# EasyEDA Pro project SoPi.epro, schematic Schematic1
Board Name: Board1; Create Date: 2026-04-29; Page Name: P1; Project Name: My_F1C200S; Schematic Name: Schematic1; Update Date: 2026-05-15; Add into BOM: yes; Company: 嘉立创EDA; Convert to PCB: yes; Page Size: A4; Version: V1.0
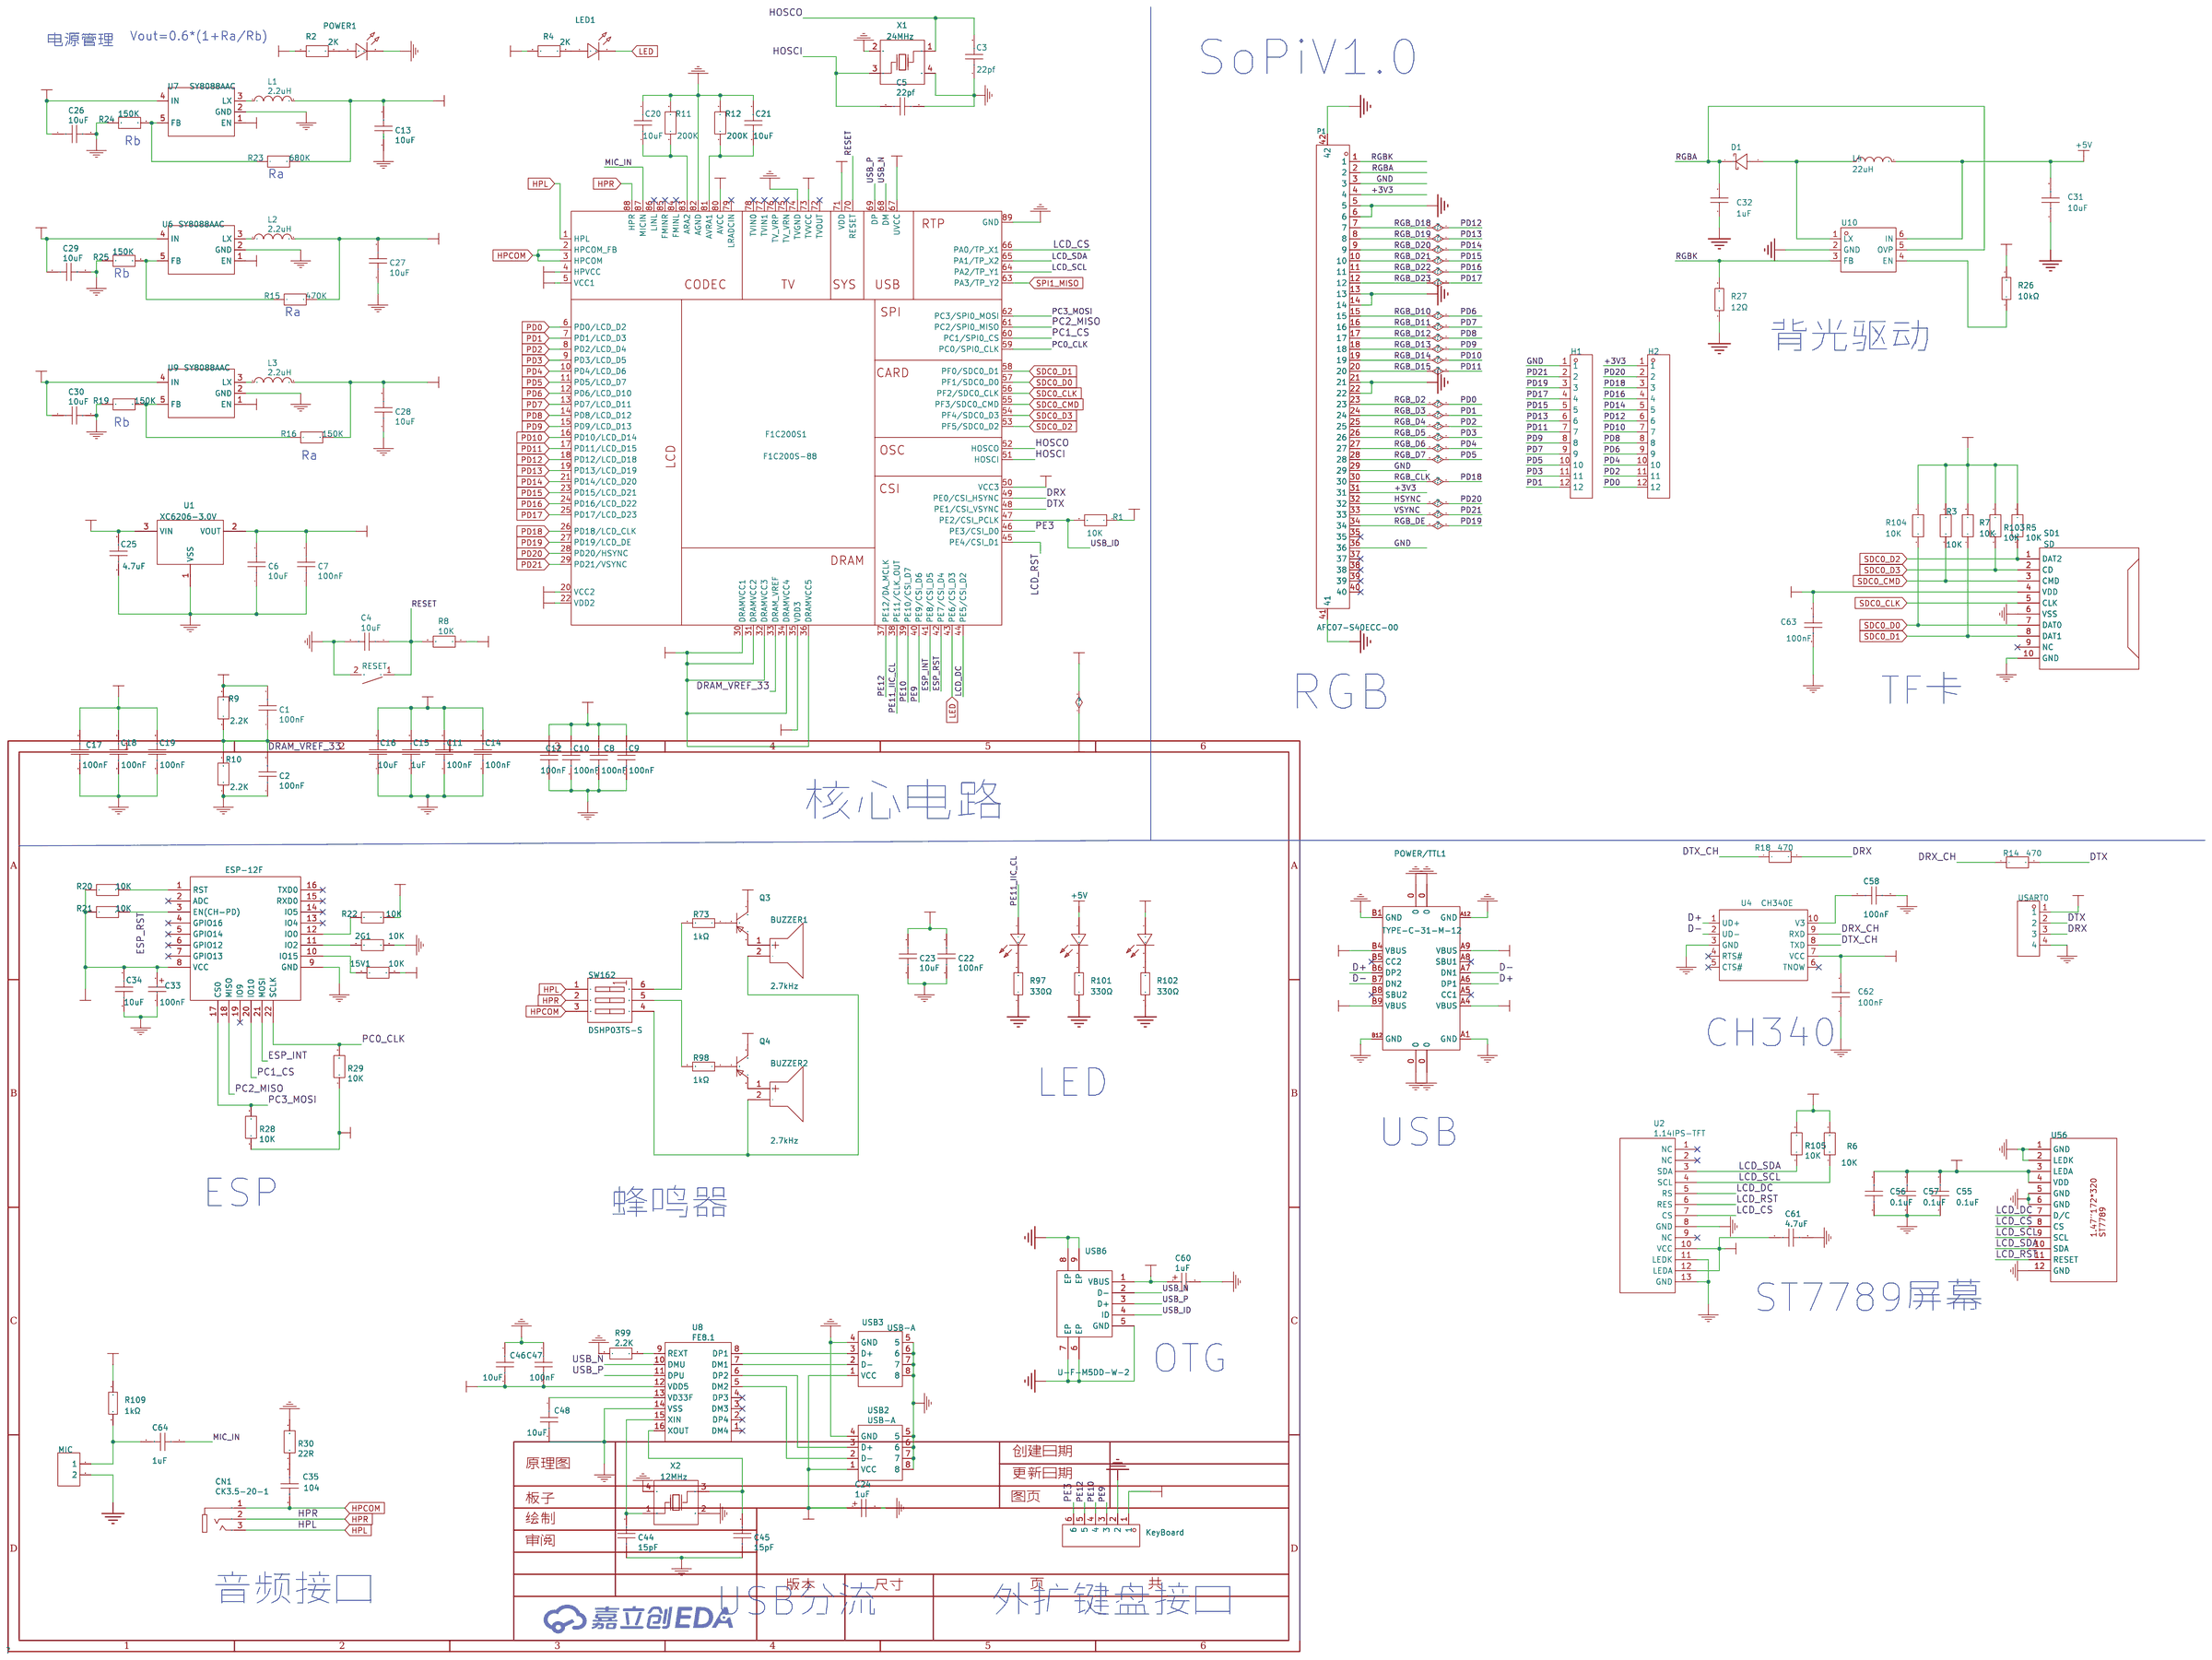
[diagram p0: schematic sheet]

## Parts
2G1  10K  [R0603]
15V1  10K  [R0603]
BUZZER1  2.7kHz  [BUZ-TH_BD9.0-P5.00-D0.6-FD]
BUZZER2  2.7kHz  [BUZ-TH_BD9.0-P5.00-D0.6-FD]
C1  100nF  [C0603]
C2  100nF  [C0603]
C3  22pf  [C0603]
C4  10uF  [C0603]
C5  22pf  [C0603]
C6  10uF  [C0603]
C7  100nF  [C0603]
C8  100nF  [C0603]
C9  100nF  [C0603]
C10  100nF  [C0603]
C11  100nF  [C0603]
C12  100nF  [C0603]
C13  10uF  [C0603]
C14  100nF  [C0603]
C15  1uF  [C0603]
C16  10uF  [C0603]
C17  100nF  [C0603]
C18  100nF  [C0603]
C19  100nF  [C0603]
C20  10uF  [C0603]
C21  10uF  [C0603]
C22  100nF  [C0603]
C23  10uF  [C0603]
C24  1uF  [CAP-SMD_L3.5-W2.8-R-RD]
C25  4.7uF  [C0603]
C26  10uF  [C0603]
C27  10uF  [C0603]
C28  10uF  [C0603]
C29  10uF  [C0603]
C30  10uF  [C0603]
C31  10uF  [C0603]
C32  1uF  [C0603]
C33  100nF  [CAP-SMD_L3.5-W2.8-R-RD]
C34  10uF  [C0603]
C35  104  [C0603]
C44  15pF  [C0603]
C45  15pF  [C0603]
C46  10uF  [C0603]
C47  100nF  [C0603]
C48  10uF  [C0603]
C55  0.1uF  [C0603]
C56  0.1uF  [C0603]
C57  0.1uF  [C0603]
C58  100nF  [C0603]
C60  1uF  [CAP-SMD_L3.5-W2.8-R-RD]
C61  4.7uF  [C0603]
C62  100nF  [C0603]
C63  100nF  [C0603]
C64  1uF  [C0603]
CN1  CK3.5-20-1  [AUDIO-SMD_CK3.5-20-1]
D1  -  [SMA_L4.3-W2.5-LS5.0-RD]
F1C200S1  F1C200S-88  [F1C100S/F1C200S]
H1  -  [HDR-TH_12P-P2.54-V-M]
H2  -  [HDR-TH_12P-P2.54-V-M]
KeyBoard  -  [HDR-TH_6P-P2.54-V-F]
L1  2.2uH  [L0805]
L2  2.2uH  [L0805]
L3  2.2uH  [L0805]
L4  22uH  [IND-SMD_L4.5-W4.0_SM4532]
LED1  0603  [LED0603_RED]
LED96  KT-0805G  [LED0805-R-RD]
LED97  KT-0805G  [LED0805-R-RD]
LED98  KT-0805G  [LED0805-R-RD]
MIC  -  [HDR-TH_2P-P2.54-V-F]
P1  AFC07-S40ECC-00  [CONN-SMD_AFC07-S40ECC-00]
POWER1  0603  [LED0603_RED]
POWER/TTL1  TYPE-C-31-M-12  [USB-C_SMD-TYPE-C-31-M-12]
Q3  S8550  [SOT-23-3_L2.9-W1.3-P1.90-LS2.4-BR]
Q4  S8550  [SOT-23-3_L2.9-W1.3-P1.90-LS2.4-BR]
R1  10K  [R0603]
R2  2K  [R0603]
R3  10K  [R0603]
R4  2K  [R0603]
R5  10K  [R0603]
R6  10K  [R0603]
R7  10K  [R0603]
R8  10K  [R0603]
R9  2.2K  [R0603]
R10  2.2K  [R0603]
R11  200K  [R0603]
R12  200K  [R0603]
R14  470  [R0603]
R15  470K  [R0603]
R16  150K  [R0603]
R18  470  [R0603]
R19  150K  [R0603]
R20  10K  [R0603]
R21  10K  [R0603]
R22  10K  [R0603]
R23  680K  [R0603]
R24  150K  [R0603]
R25  150K  [R0603]
R26  10kΩ  [R0603]
R27  12Ω  [R0603]
R28  10K  [R0603]
R29  10K  [R0603]
R30  22R  [R0603]
R73  1kΩ  [R0603]
R97  330Ω  [R0603]
R98  1kΩ  [R0603]
R99  2.2K  [R0603]
R101  330Ω  [R0603]
R102  330Ω  [R0603]
R103  10K  [R0603]
R104  10K  [R0603]
R105  10K  [R0603]
R109  1kΩ  [R0603]
RESET  ST-1185S  [SW-SMD_ST-1185S]
SD1  SD  [TF-SMD_TF-115K]
SW162  DSHP03TS-S  [SW-SMD_DSHP03TS-S]
U1  XC6206-3.0V  [SOT-23]
U2  1.14IPS-TFT  [1.14IPS]
U3  ESP-12F  [WIFIM-SMD_ESP-12F-ESP8266MOD]
U4  CH340E  [MSOP-10_L3.0-W3.0-P0.50-LS5.0-BL]
U6  SY8088AAC  [SOT-23-5_L3.0-W1.7-P0.95-LS2.8-BR]
U7  SY8088AAC  [SOT-23-5_L3.0-W1.7-P0.95-LS2.8-BR]
U8  FE8.1  [SSOP-16_L4.9-W3.9-P0.64-LS6.0-BL]
U9  SY8088AAC  [SOT-23-5_L3.0-W1.7-P0.95-LS2.8-BR]
U10  RY3730  [SOT-23-6_L2.9-W1.6-P0.95-LS2.8-BL]
U56  -  [1.47ST7789]
USART0  PZ254V-11-04P  [HDR-TH_4P-P2.54-V-M]
USB2  USB-A  [USB-A]
USB3  USB-A  [USB-A]
USB6  U-F-M5DD-W-2  [MICRO-USB-SMD_MICRO-USB-A17]
X1  24MHz  [OSC-SMD_4P-L3.2-W2.5-BL]
X2  12MHz  [OSC-SMD_4P-L3.2-W2.5-BL]

## Library data of the parts
2G1 15V1 R1 R3 R5-R8 R20-R22 R28 R29 R103-R105 = 10K: Supplier: LCSC; Supplier Part: C465746; Manufacturer: PANASONIC; Manufacturer Part: ERA3ARB103V; JLCPCB Part Class: Extended Part
BUZZER1 BUZZER2 = GMD0955YB-3V2700: 驱动方式:有源(内含驱动线路);构造类型:电磁式;频率:2.7kHz;声压(SPL):80dB@3V,10cm;; Supplier Part: C252933; Manufacturer: INGHAi(赢海); JLCPCB Part Class: Extended Part; Datasheet: https://atta.szlcsc.com/upload/public/pdf/source/20200113/C252933_0808B968C54230937A04AB87C18560D6.pdf; Supplier: LCSC; Oscillator Circuit: 有源(内含驱动线路); Technology Type: 电磁式; Operating Voltage: 2V~5V; Sound Pressure Level (SPL): 80dB@3V,10cm; Diameter (φD): 9mm; Height: 5.5mm
C1 C2 C7-C12 C14 C17-C19 C22 C47 C58 C62 C63 = 100nF: Supplier: LCSC; Supplier Part: C524952; Manufacturer: Taiyo Yuden; Manufacturer Part: AMK107BJ106MA-T
C3 C5 = 15pf: Supplier: LCSC; Supplier Part: C524952; Manufacturer: Taiyo Yuden; Manufacturer Part: AMK107BJ106MA-T
C4 C6 C13 C16 C20 C21 C23 C26-C30 C34 C46 C48 = 10uF: Supplier: LCSC; Supplier Part: C524952; Manufacturer: Taiyo Yuden; Manufacturer Part: AMK107BJ106MA-T
C15 C64 = 1uF: Supplier: LCSC; Supplier Part: C524952; Manufacturer: Taiyo Yuden; Manufacturer Part: AMK107BJ106MA-T
C24 C60 = 1uF: Supplier: LCSC; Manufacturer: AVX; Manufacturer Part: TAJB105K035RNJ; Supplier Part: C7192; JLCPCB Part Class: Extend; JLCPCB SMD: Yes
C25 C55-C57 C61 = 4.7uF: Supplier: LCSC; Supplier Part: C524952; Manufacturer: Taiyo Yuden; Manufacturer Part: AMK107BJ106MA-T
C31 = CL10A106KP8NNNC: 容值:10uF;精度:±10%;额定电压:10V;材质(温度系数):X5R;; LCSC Part Name: 10uF ±10% 10V; Supplier Part: C19702; Manufacturer: SAMSUNG(三星); Supplier Footprint: 0603; JLCPCB Part Class: Basic Part; Datasheet: https://atta.szlcsc.com/upload/public/pdf/source/20160103/1457707703378.pdf; Supplier: LCSC; Tolerance: ±10%; Voltage Rated: 10V; Temperature Coefficient: X5R
C32 = CL10A105KB8NNNC: 容值:1uF;精度:±10%;额定电压:50V;材质(温度系数):X5R;; LCSC Part Name: 1uF ±10% 50V; Supplier Part: C15849; Manufacturer: SAMSUNG(三星); Supplier Footprint: 0603; JLCPCB Part Class: Basic Part; Datasheet: https://atta.szlcsc.com/upload/public/pdf/source/20160103/1457707679084.pdf; Supplier: LCSC; Tolerance: ±10%; Voltage Rated: 50V; Temperature Coefficient: X5R
C33 = 100nF: Supplier: LCSC; Manufacturer: AVX; Manufacturer Part: TAJB105K035RNJ; Supplier Part: C7192; JLCPCB Part Class: Extend; JLCPCB SMD: Yes
C35 = 104
C44 C45 = 15pF
CN1 = CK3.5-20-1: Supplier: LCSC; Supplier Part: C718046; Manufacturer: JINJIA
D1 = SS34: 二极管配置:独立式;直流反向耐压(Vr):45V;平均整流电流(Io):3A;正向压降(Vf):550mV@3A;反向电流(Ir):500A@45V;; LCSC Part Name: 45V 3A 550mV@3A; Supplier Part: C2900685; Manufacturer: BLUE ROCKET(蓝箭); Supplier Footprint: SMA; JLCPCB Part Class: Extended Part; Datasheet: https://atta.szlcsc.com/upload/public/pdf/source/20211019/D690381062792463711EAF5143529E57.pdf; Supplier: LCSC; Diode Configuration: 独立式; Reverse Voltage (Vr): 45V; Average Rectified Current (Io): 3A; Forward Voltage (Vf@If): 550mV@3A; Reverse Leakage Current (Ir): 500A@45V
F1C200S1 = F1C200S-88: Manufacturer: Allwinner; Supplier: LCSC
H1 H2 = HDR-M_2.54_1x12P: 间距:2.54mm;总PIN位数:12;排数:1;插针结构:1x12P;行距:-;安装类型:直插;圆针/方针:方针;额定电流:3A;额定电压:250V;配合针长度:6mm;塑高:2.5mm;端接针长度:3mm;触头材质:-;工作温度范围:-40℃~+105℃;颜色:黑色;; Supplier Part: C2840012; Supplier Footprint: 插件
KeyBoard = HDR-F_2.54_1x6P: Supplier Part: C40877; Supplier Footprint: 插件
L1-L3 = 2.2uH: Supplier: LCSC; Manufacturer Part: CMI201209U2R2KT; Manufacturer: FH; Supplier Part: C1043; JLCPCB Part Class: Basic; JLCPCB SMD: Yes
L4 = GCD43-220MC: 电感值:22uH;精度:±20%;额定电流:1A;直流电阻(DCR):375mΩ;; LCSC Part Name: 22uH ±20% 1A 375mΩ; Supplier Part: C439244; Manufacturer: GLE(格莱尔); Supplier Footprint: SMD; JLCPCB Part Class: Extended Part; Datasheet: https://atta.szlcsc.com/upload/public/pdf/source/20191226/C439244_68427D11A7C3652EC048C5CEB2B3AA76.pdf; Supplier: LCSC; Tolerance: ±20%; Rated Current: 1A; DC Resistance (DCR): 375mΩ
LED1 POWER1 = 0603: Manufacturer: EVERLIGHT(台湾亿光); Manufacturer Part: 19-217/R6C-AL1M2VY/3T; Supplier Part: C72044; Supplier: LCSC
LED96-LED98 = KT-0805G: 灯头类型:-;发光颜色:翠绿色;正向电压(VF):-;功率:-;正向电流:-;主波长:-;二极管配置:-;透镜颜色:-;色温:-;发光强度:-;发光角度:-;载带方式:-;工作温度:-;; LCSC Part Name: 0805 翠绿 高亮; Supplier Part: C2297; Manufacturer: KENTO; Supplier Footprint: 0805; JLCPCB Part Class: 基础库; Datasheet: https://atta.szlcsc.com/upload/public/pdf/source/20170209/1486607340485.pdf; Supplier: LCSC; Emitted Color: 翠绿色
MIC = HDR-F_2.54_1x2P: Supplier Part: C49661; Supplier Footprint: 插件
P1 = AFC07-S40ECC-00: 间距:0.5mm;触点数量:40P;锁定特性:抽屉式;安装类型:卧贴;触点类型:上接;; LCSC Part Name: 0.5mm P数:40P 抽屉式 上接; Supplier Part: C11097; Manufacturer: JS(钜硕电子); Supplier Footprint: SMD,P=0.5mm; JLCPCB Part Class: Extended Part; Datasheet: https://atta.szlcsc.com/upload/public/pdf/source/20130129/1457706582878.pdf; Supplier: LCSC; Pitch: 0.5mm; Number of Contacts: 40P; Locking Feature: 抽屉式; Mounting Type: 卧贴; Contact Type: 上接; Height Above Board: 2mm; FFC, FCB Thickness: 0.3mm
POWER/TTL1 = TYPE-C-31-M-12: Supplier: LCSC; Supplier Part: C165948; Manufacturer: Rectangular Connectors - Contacts
Q3 Q4 = S8550_C2891805: Supplier Part: C2891805; Manufacturer: YONGYUTAI(永裕泰); Supplier Footprint: SOT-23; JLCPCB Part Class: 扩展库; Datasheet: https://atta.szlcsc.com/upload/public/pdf/source/20210901/65C3C4D1695A9271DEFEFE0B623CB3B1.pdf; Supplier: LCSC
R2 R4 = 2K: Supplier: LCSC; Supplier Part: C429019; Manufacturer: Ever Ohms Tech; Manufacturer Part: CR0603F12R4P05
R9 R10 R99 = 2.2K: Supplier: LCSC; Supplier Part: C465746; Manufacturer: PANASONIC; Manufacturer Part: ERA3ARB103V; JLCPCB Part Class: Extended Part
R11 R12 = 200K: Supplier: LCSC; Supplier Part: C465746; Manufacturer: PANASONIC; Manufacturer Part: ERA3ARB103V; JLCPCB Part Class: Extended Part
R14 R18 = 470: Supplier: LCSC; Supplier Part: C465746; Manufacturer: PANASONIC; Manufacturer Part: ERA3ARB103V; JLCPCB Part Class: Extended Part
R15 = 470K: Supplier: LCSC; Supplier Part: C465746; Manufacturer: PANASONIC; Manufacturer Part: ERA3ARB103V; JLCPCB Part Class: Extended Part
R16 R19 R24 R25 = 150K: Supplier: LCSC; Supplier Part: C465746; Manufacturer: PANASONIC; Manufacturer Part: ERA3ARB103V; JLCPCB Part Class: Extended Part
R23 = 680K: Supplier: LCSC; Supplier Part: C465746; Manufacturer: PANASONIC; Manufacturer Part: ERA3ARB103V; JLCPCB Part Class: Extended Part
R26 = 0603WAF1002T5E: 阻值:10kΩ;精度:±1%;功率:100mW;温度系数:±100ppm/℃;电阻类型:厚膜电阻;; LCSC Part Name: 10kΩ ±1% 100mW 厚膜电阻; Supplier Part: C25804; Manufacturer: UNI-ROYAL(厚声); Supplier Footprint: 0603; JLCPCB Part Class: Basic Part; Datasheet: https://atta.szlcsc.com/upload/public/pdf/source/20200306/C422600_1E6D84923E4A46A82E41ADD87F860B5C.pdf; Supplier: LCSC; Tolerance: ±1%; Power(Watts): 100mW; Overload Voltage (Max): 75V; Temperature Coefficient: ±100ppm/℃; Type: 厚膜电阻; Operating Temperature Range: -55℃~+155℃
R27 = RS-03K12R0FT: 阻值:12Ω;精度:±1%;功率:100mW;温度系数:±100ppm/℃;; LCSC Part Name: 12Ω ±1% 100mW; Supplier Part: C310268; Manufacturer: FH(风华); Supplier Footprint: 0603; JLCPCB Part Class: Extended Part; Datasheet: https://atta.szlcsc.com/upload/public/pdf/source/20180927/C310268_81D91F4EFBEFB660CE5EA636240332E4.pdf; Supplier: LCSC; Tolerance: ±1%; Power(Watts): 100mW; Temperature Coefficient: ±100ppm/℃; Overload Voltage (Max): 50V; Operating Temperature Range: -55℃~+155℃
R30 = 22R
R73 R98 R109 = 0603WAF1001T5E: 电阻类型:厚膜电阻;阻值:1kΩ;精度:±1%;功率:100mW;; LCSC Part Name: 1kΩ ±1% 100mW; Supplier Part: C21190; Manufacturer: UNI-ROYAL(厚声); Supplier Footprint: 0603; JLCPCB Part Class: Basic Part; Datasheet: https://atta.szlcsc.com/upload/public/pdf/source/20200306/C422600_1E6D84923E4A46A82E41ADD87F860B5C.pdf; Supplier: LCSC; Type: 厚膜电阻; Tolerance: ±1%; Power(Watts): 100mW; Temperature Coefficient: ±100ppm/℃; Overload Voltage (Max): 75V; Operating Temperature Range: -55℃~+155℃
R97 R101 R102 = 0603WAF3300T5E: 电阻类型:厚膜电阻;阻值:330Ω;精度:±1%;功率:100mW;最大工作电压:75V;温度系数:±100ppm/℃;; LCSC Part Name: 330Ω ±1% 100mW 厚膜电阻; Supplier Part: C23138; Manufacturer: UNI-ROYAL(厚声); Supplier Footprint: 0603; JLCPCB Part Class: 基础库; Datasheet: https://atta.szlcsc.com/upload/public/pdf/source/20200306/C422600_1E6D84923E4A46A82E41ADD87F860B5C.pdf; Supplier: LCSC; Type: 厚膜电阻; Tolerance: ±1%; Power(Watts): 100mW; Overload Voltage (Max): 75V; Temperature Coefficient: ±100ppm/℃; Operating Temperature Range: -55℃~+155℃
RESET = ST-1185S: Supplier: LCSC; Supplier Part: C589191; Manufacturer: RI SHENG; JLCPCB Part Class: Extended Part
SD1 = SD
SW162 = DSHP03TS-S: 类型:平拨,凹槽式;电路结构:单刀单掷;开关位数:3位;额定电流:25mA;额定电压:24V;使用寿命:3千次;颜色:黑色;; LCSC Part Name: 间距1.27mm 平拨,凹槽式 3位拨码开关; Supplier Part: C319051; Manufacturer: XKB Connectivity(中国星坤); Supplier Footprint: SMD-6P,5.4x5.4mm; JLCPCB Part Class: Extended Part; Datasheet: https://atta.szlcsc.com/upload/public/pdf/source/20211009/11BE85C99D2C85B0991AF4F9D6EB8BDE.pdf; Supplier: LCSC; Type: 平拨,凹槽式; Circuit: 单刀单掷; Number of Positions: 3位; Pin Style: 鸥翼型; Lead Pitch: 1.27mm; Current Rating: 25mA; Voltage Rating: 24V; Operating Temperature: -20℃~+70℃; Operating Life: 3千次; Color: 黑色
U1 = XC6206-3.0V: Supplier: LCSC; Supplier Part: C17167; Manufacturer: Torex Semicon; Manufacturer Part: XC6206P232MR
U2 = 1.14IPS-TFT
U3 = ESP-12F: Supplier: LCSC; Manufacturer: Ai-Thinker; Manufacturer Part: ESP-12F(ESP8266MOD); Supplier Part: C82891
U4 = CH340E: Supplier: LCSC; Manufacturer: WCH; Supplier Part: C99652; JLCPCB Part Class: Extend
U6 U7 U9 = SY8088AAC: Supplier: LCSC; Manufacturer: Silergy; Supplier Part: C79313; JLCPCB Part Class: Extend
U8 = FE8.1: Manufacturer: terminus-usa; Manufacturer Part: FE8.1-FSOP16A; link: https://terminus-usa.com/product/fe8-1-usb2-0-high-speed-4-port-hub-controller/
U10 = RY3730: LCSC Part Name: RY3730 WLED Driver, 2.5-5.5V, 8Series WLED Driver, 1.2MHz, SOT23-6; Supplier Part: C370887; Manufacturer: RYCHiP(蕊源); Supplier Footprint: SOT-23-6; JLCPCB Part Class: Extended Part; Datasheet: https://atta.szlcsc.com/upload/public/pdf/source/20190329/C370887_F149D316440A2ABDFE08FA1E0696DEE8.pdf; Supplier: LCSC
U56 = 1.47寸172*320LCD串口屏ST7789
USART0 = PZ254V-11-04P: 插针结构:1x4P;间距:2.54mm;行距:-;圆针/方针:方针;安装方式:直插;排数:单排;总PIN位数:4P;额定电流:3A;额定电压:250V;配合针长度:6mm;塑高:2.5mm;端接针长度:3mm;触头材质:-;工作温度:-40℃~+105℃;颜色:黑色;; LCSC Part Name: 1x4P 间距:2.54mm 方针 直插; Supplier Part: C2691448; Manufacturer: XFCN(兴飞); Supplier Footprint: 插件,P=2.54mm; JLCPCB Part Class: 扩展库; Datasheet: https://item.szlcsc.com/datasheet/PZ254V-11-04P/2801085.html; Supplier: LCSC; Pin Structure: 1x4P; Pitch: 2.54mm; Circluar Pins/Square Pins: 方针; Mounting Type: 直插; Number of Rows: 单排; Number of Pins: 4P; Current Rating: 3A; Voltage Rating (Max): 250V; Length of Mating Pin: 6mm; Insulation Height: 2.5mm; Length of End Connection Pin: 3mm; Operating Temperature: -40℃~+105℃; Color: 黑色
USB2 USB3 = USB-A: Supplier: LCSC; Supplier Part: C42531; Manufacturer: LCSC; Manufacturer Part: USB-AF-SMD-12.8X10-H5.7; JLCPCB Part Class: Extended Part
USB6 = U-F-M5DD-W-2: 连接器类型:Micro-B;标准:USB 2.0;公母:母座;触点数量:5;端口数量:1;; LCSC Part Name: Micro-B 母座; Supplier Part: C145793; Manufacturer: 韩国韩荣; Supplier Footprint: SMD; JLCPCB Part Class: Extended Part; Datasheet: https://atta.szlcsc.com/upload/public/pdf/source/20200930/C879723_6542CD70930DA81B6877F7A914B29468.pdf; Supplier: LCSC; Connector Type: Micro-B; Standard: USB 2.0; Gender: 母座; Number of Contacts: 5; Number of Ports: 1
X1 = 24MHz: Supplier: LCSC; Manufacturer: YXC; Manufacturer Part: X322524MSB4SI; Supplier Part: C15643; JLCPCB Part Class: Extend; JLCPCB SMD: Yes
X2 = 12MHz: Supplier: LCSC; Supplier Part: C164053; Manufacturer: Zhejiang Abel Elec; Manufacturer Part: SMD-3225_4P27.12MHZ20PF10PPM-40~+85℃; JLCPCB Part Class: Extend; JLCPCB SMD: Yes

## Nets
+1V1: C17.2 C18.2 C19.2 C28.2 F1C200S1.22(VDD2) F1C200S1.35(VDD3) F1C200S1.71(VDD) L3.2 R16.2
+2V5: C1.2 C11.2 C14.2 C15.2 C16.2 C27.2 F1C200S1.30(DRAMVCC1) F1C200S1.31(DRAMVCC2) F1C200S1.32(DRAMVCC3) F1C200S1.34(DRAMVCC4) F1C200S1.36(DRAMVCC5) L2.2 R9.2 R15.2
+3V0: C6.2 C7.2 F1C200S1.80(AVCC) U1.2(VOUT)
+3V3: 15V1.1 C8.1 C9.2 C10.2 C12.1 C13.2 C33.1 C34.1 C55.2 C56.2 C57.2 C61.1 C63.1 F1C200S1.4(HPVCC) F1C200S1.5(VCC1) F1C200S1.20(VCC2) F1C200S1.50(VCC3) F1C200S1.67(UVCC) F1C200S1.73(TVVCC) H2.1 KeyBoard.1 L1.2 LED98.1(A) P1.4 P1.31 Q3.3(C) Q4.3(C) R1.1 R3.1 R4.1 R5.1 R6.2 R7.2 R8.1 R20.1 R21.1 R22.2 R23.2 R26.2 R28.1 R29.1 R103.1 R104.1 R105.2 R109.1 SD1.4(VDD) U2.10(VCC) U2.12(LEDA) U3.8(VCC) U56.3(LEDA) U56.4(VDD)
+5V: C22.1 C23.1 C24.1 C25.2 C26.1 C29.1 C30.1 C31.2 C46.2 C47.2 C60.1 C62.2 L4.2 LED97.1(A) POWER/TTL1.A4(VBUS) POWER/TTL1.A9(VBUS) POWER/TTL1.B4(VBUS) POWER/TTL1.B9(VBUS) R2.1 U1.3(VIN) U4.7(VCC) U6.1(EN) U6.4(IN) U7.1(EN) U7.4(IN) U8.12(VDD5) U9.1(EN) U9.4(IN) U10.6(IN) USART0.1 USB2.1(VCC) USB3.1(VCC) USB6.1(VBUS)
GND: 2G1.1 C2.1 C3.1 C4.2 C5.1 C6.1 C7.1 C8.2 C9.1 C10.1 C11.1 C12.2 C13.1 C14.1 C15.1 C16.1 C17.1 C18.1 C19.1 C20.2 C21.2 C22.2 C23.2 C24.2 C25.1 C26.2 C27.1 C28.1 C29.2 C30.2 C31.1 C32.1 C33.2 C34.2 C44.1 C45.1 C46.1 C47.1 C48.2 C55.1 C56.1 C57.1 C58.2 C60.2 C61.2 C62.1 C63.2 F1C200S1.74(TVGND) F1C200S1.82(AGND) F1C200S1.89(GND) H1.1 KeyBoard.2 MIC.2 P1.3 P1.5 P1.6 P1.13 P1.14 P1.21 P1.22 P1.29 P1.36 P1.41 P1.42 POWER1.2 POWER/TTL1.0 POWER/TTL1.A1(GND) POWER/TTL1.A12(GND) POWER/TTL1.B1(GND) POWER/TTL1.B12(GND) R10.1 R11.2 R12.2 R19.1 R24.1 R25.1 R27.1 R30.2 R97.1 R99.1 R101.1 R102.1 RESET.2 SD1.6(VSS) SD1.10(GND) U1.1(VSS) U2.8(GND) U2.11(LEDK) U2.13(GND) U3.9(GND) U4.3(GND) U6.2(GND) U7.2(GND) U8.14(VSS) U9.2(GND) U10.2(GND) U56.1(GND) U56.2(LEDK) U56.5(GND) U56.6(GND) U56.12(GND) USART0.4 USB2.4(GND) USB2.5 USB2.6 USB2.7 USB2.8 USB3.4(GND) USB3.5 USB3.6 USB3.7 USB3.8 USB6.5(GND) USB6.6(EP) USB6.7(EP) USB6.8(EP) USB6.9(EP) X1.2(GND) X1.4(GND) X2.2(GND) X2.4(GND)
D+: POWER/TTL1.A6(DP1) POWER/TTL1.B6(DP2) U4.1(UD+)
D-: POWER/TTL1.A7(DN1) POWER/TTL1.B7(DN2) U4.2(UD-)
DRAM_VREF_33: C1.1 C2.2 F1C200S1.33(DRAM_VREF) R9.1 R10.2
DRX: F1C200S1.49(PE0/CSI_HSYNC) R18.2 USART0.3
DRX_CH: R14.1 U4.9(RXD)
DTX: F1C200S1.48(PE1/CSI_VSYNC) R14.2 USART0.2
DTX_CH: R18.1 U4.8(TXD)
ESP_INT: F1C200S1.41(PE8/CSI_D5) U3.21(MOSI)
ESP_RST: F1C200S1.42(PE7/CSI_D4) R21.2 U3.3(EN(CH-PD))
HOSCI: C5.2 F1C200S1.51(HOSCI) X1.3(OSC2)
HOSCO: C3.2 F1C200S1.52(HOSCO) X1.1(OSC1)
HPCOM: C35.1 CN1.1 F1C200S1.2(HPCOM_FB) F1C200S1.3(HPCOM) SW162.3
HPL: CN1.3 F1C200S1.1(HPL) SW162.1
HPR: CN1.2 F1C200S1.88(HPR) SW162.2
HSYNC: F1C200S1.28(PD20/HSYNC) H2.2 P1.32
LCD_CS: F1C200S1.66(PA0/TP_X1) U2.7(CS) U56.8(CS)
LCD_DC: F1C200S1.44(PE5/CSI_D2) U2.5(RS) U56.7(D/C)
LCD_RST: F1C200S1.45(PE4/CSI_D1) U2.6(RES) U56.11(RESET)
LCD_SCL: F1C200S1.64(PA2/TP_Y1) R6.1 U2.4(SCL) U56.9(SCL)
LCD_SDA: F1C200S1.65(PA1/TP_X2) R105.1 U2.3(SDA) U56.10(SDA)
LED: F1C200S1.43(PE6/CSI_D3) LED1.2
MIC_IN: C64.1 F1C200S1.87(MICIN)
PC0_CLK: F1C200S1.59(PC0/SPI0_CLK) R29.2 U3.22(SCLK)
PC1_CS: F1C200S1.60(PC1/SPI0_CS) U3.20(IO10)
PC2_MISO: F1C200S1.61(PC2/SPI0_MISO) U3.18(MISO)
PC3_MOSI: F1C200S1.62(PC3/SPI0_MOSI) R28.2 U3.17(CS0)
PD0: F1C200S1.6(PD0/LCD_D2) H2.12 P1.23
PD1: F1C200S1.7(PD1/LCD_D3) H1.12 P1.24
PD2: F1C200S1.8(PD2/LCD_D4) H2.11 P1.25
PD3: F1C200S1.9(PD3/LCD_D5) H1.11 P1.26
PD4: F1C200S1.10(PD4/LCD_D6) H2.10 P1.27
PD5: F1C200S1.11(PD5/LCD_D7) H1.10 P1.28
PD6: F1C200S1.12(PD6/LCD_D10) H2.9 P1.15
PD7: F1C200S1.13(PD7/LCD_D11) H1.9 P1.16
PD8: F1C200S1.14(PD8/LCD_D12) H2.8 P1.17
PD9: F1C200S1.15(PD9/LCD_D13) H1.8 P1.18
PD10: F1C200S1.16(PD10/LCD_D14) H2.7 P1.19
PD11: F1C200S1.17(PD11/LCD_D15) H1.7 P1.20
PD12: F1C200S1.18(PD12/LCD_D18) H2.6 P1.7
PD13: F1C200S1.19(PD13/LCD_D19) H1.6 P1.8
PD14: F1C200S1.21(PD14/LCD_D20) H2.5 P1.9
PD15: F1C200S1.23(PD15/LCD_D21) H1.5 P1.10
PD16: F1C200S1.24(PD16/LCD_D22) H2.4 P1.11
PD17: F1C200S1.25(PD17/LCD_D23) H1.4 P1.12
PD18: F1C200S1.26(PD18/LCD_CLK) H2.3 P1.30
PD19: F1C200S1.27(PD19/LCD_DE) H1.3 P1.34
PD21: F1C200S1.29(PD21/VSYNC) H1.2 P1.33
PE3: F1C200S1.46(PE3/CSI_D0) KeyBoard.6
PE9: F1C200S1.40(PE9/CSI_D6) KeyBoard.3
PE10: F1C200S1.39(PE10/CSI_D7) KeyBoard.4
PE11_IIC_CL: F1C200S1.38(PE11/CLK_OUT) LED96.1(A)
PE12: F1C200S1.37(PE12/DA_MCLK) KeyBoard.5
RESET: C4.1 F1C200S1.70(RESET) R8.2 RESET.1
RGBA: C32.2 D1.1(K) P1.2 U10.5(OVP)
RGBK: P1.1 R27.2 U10.3(FB)
SDC0_CLK: F1C200S1.56(PF2/SDC0_CLK) SD1.5(CLK)
SDC0_CMD: F1C200S1.55(PF3/SDC0_CMD) R3.2 SD1.3(CMD)
SDC0_D0: F1C200S1.57(PF1/SDC0_D0) R104.2 SD1.7(DAT0)
SDC0_D1: F1C200S1.58(PF0/SDC0_D1) R7.1 SD1.8(DAT1)
SDC0_D2: F1C200S1.53(PF5/SDC0_D2) R5.2 SD1.1(DAT2)
SDC0_D3: F1C200S1.54(PF4/SDC0_D3) R103.2 SD1.2(CD)
SPI1_MISO: F1C200S1.63(PA3/TP_Y2)
USB_ID: F1C200S1.47(PE2/CSI_PCLK) R1.2 USB6.4(ID)
USB_N: F1C200S1.68(DM) U8.10(DMU) USB6.2(D-)
USB_P: F1C200S1.69(DP) U8.11(DPU) USB6.3(D+)
$1N3555: C21.1 F1C200S1.81(AVRA1) R12.1
$1N3556: C20.1 F1C200S1.83(ARA2) R11.1
$1N3572: L1.1 U7.3(LX)
$1N3575: L2.1 U6.3(LX)
$1N3576: L3.1 U9.3(LX)
$1N3577: R23.1 R24.2 U7.5(FB)
$1N3582: R15.1 R25.2 U6.5(FB)
$1N3583: R16.1 R19.2 U9.5(FB)
$1N3737: LED1.1 R4.2
$1N3738: POWER1.1 R2.2
$1N25347: D1.2(A) L4.1 U10.1(LX)
$1N25348: R26.1 U10.4(EN)
$1N25744: 2G1.2 U3.11(IO2)
$1N25746: R22.1 U3.12(IO0)
$1N25747: 15V1.2 U3.10(IO15)
$1N25764: R20.2 U3.1(RST)
$1N25889: C35.2 R30.1
$1N26206: BUZZER1.2(-) BUZZER2.2(-) SW162.4
$1N26210: BUZZER2.1(+) Q4.2(E)
$1N26212: BUZZER1.1(+) Q3.2(E)
$1N26214: Q4.1(B) R98.1
$1N26215: R98.2 SW162.5
$1N26216: Q3.1(B) R73.1
$1N26217: R73.2 SW162.6
$1N26707: R99.2 U8.9(REXT)
$1N26708: C45.2 U8.16(XOUT) X2.3(OSC2)
$1N26711: C44.2 U8.15(XIN) X2.1(OSC1)
$1N26715: C48.1 U8.13(VD33F)
$1N26719: U8.5(DM2) USB2.2(D-)
$1N26720: U8.6(DP2) USB2.3(D+)
$1N26721: U8.8(DP1) USB3.3(D+)
$1N26722: U8.7(DM1) USB3.2(D-)
$1N27551: LED96.2(K) R97.2
$1N27555: LED97.2(K) R101.2
$1N27558: LED98.2(K) R102.2
$1N27648: C58.1 U4.10(V3)
$1N49702: C64.2 MIC.1 R109.2

Not connected (* = marked no-connect by the designer): F1C200S1 72(TVOUT)* 75(TV_VRN)* 76(TV_VRP)* 77(TVIN1)* 78(TVIN0)* 79(LRADCIN)* 84(FMINL)* 85(FMINR)* 86(LINL)*; P1 35* 37* 38* 39* 40*; POWER/TTL1 A5(CC1)* A8(SBU1)* B5(CC2)* B8(SBU2)*; SD1 9(NC)*; U2 1(NC)* 2(NC)* 9(NC)*; U3 2(ADC)* 4(GPIO16)* 5(GPIO14)* 6(GPIO12)* 7(GPIO13)* 13(IO4)* 14(IO5)* 15(RXD0)* 16(TXD0)* 19(IO9)*; U4 4(RTS#)* 5(CTS#)* 6(TNOW)*; U8 1(DM4)* 2(DP4)* 3(DM3)* 4(DP3)*

## Notes on the sheet
- 电源管理
- Vout=0.6*(1+Ra/Rb)
- SoPiV1.0
- Rb
- Ra
- Rb
- Ra
- 背光驱动
- Rb
- Ra
- RGB
- TF卡
- 核心电路
- CH340
- LED
- USB
- ESP
- 蜂鸣器
- ST7789屏幕
- OTG
- 音频接口
- USB分流
- 外扩键盘接口
